# Altium schematic sheet BGA Modules.SchDoc: Schematic Sheet Test Title
size C; Organization: CXQ; Address1: RM 7401, 550 Jumen Rd, Huangpu District, Shanghai, China; Address2: Huangpu District; Address3: Shanghai; Address4: China; Revision: MB0004-01.A.1; SheetNumber: 1; SheetTotal: 99; PageSetup: Record=PageOptions|CenterHorizontal=True|CenterVertical=True|PrintScale=0.98|XCorrection=1.00|YCorrection=1.00|PrintKind=0|BorderSize=5000000|LeftOffset=0|BottomOffset=0|Orientation=2|PaperLength=1000|PaperWidth=1000|Scale=100|PaperSource=7|PrintQuality=-4|MediaType=1|DitherType=10|PaperKind=A4|PrintScaleMode=1; ProjectName: Project Name
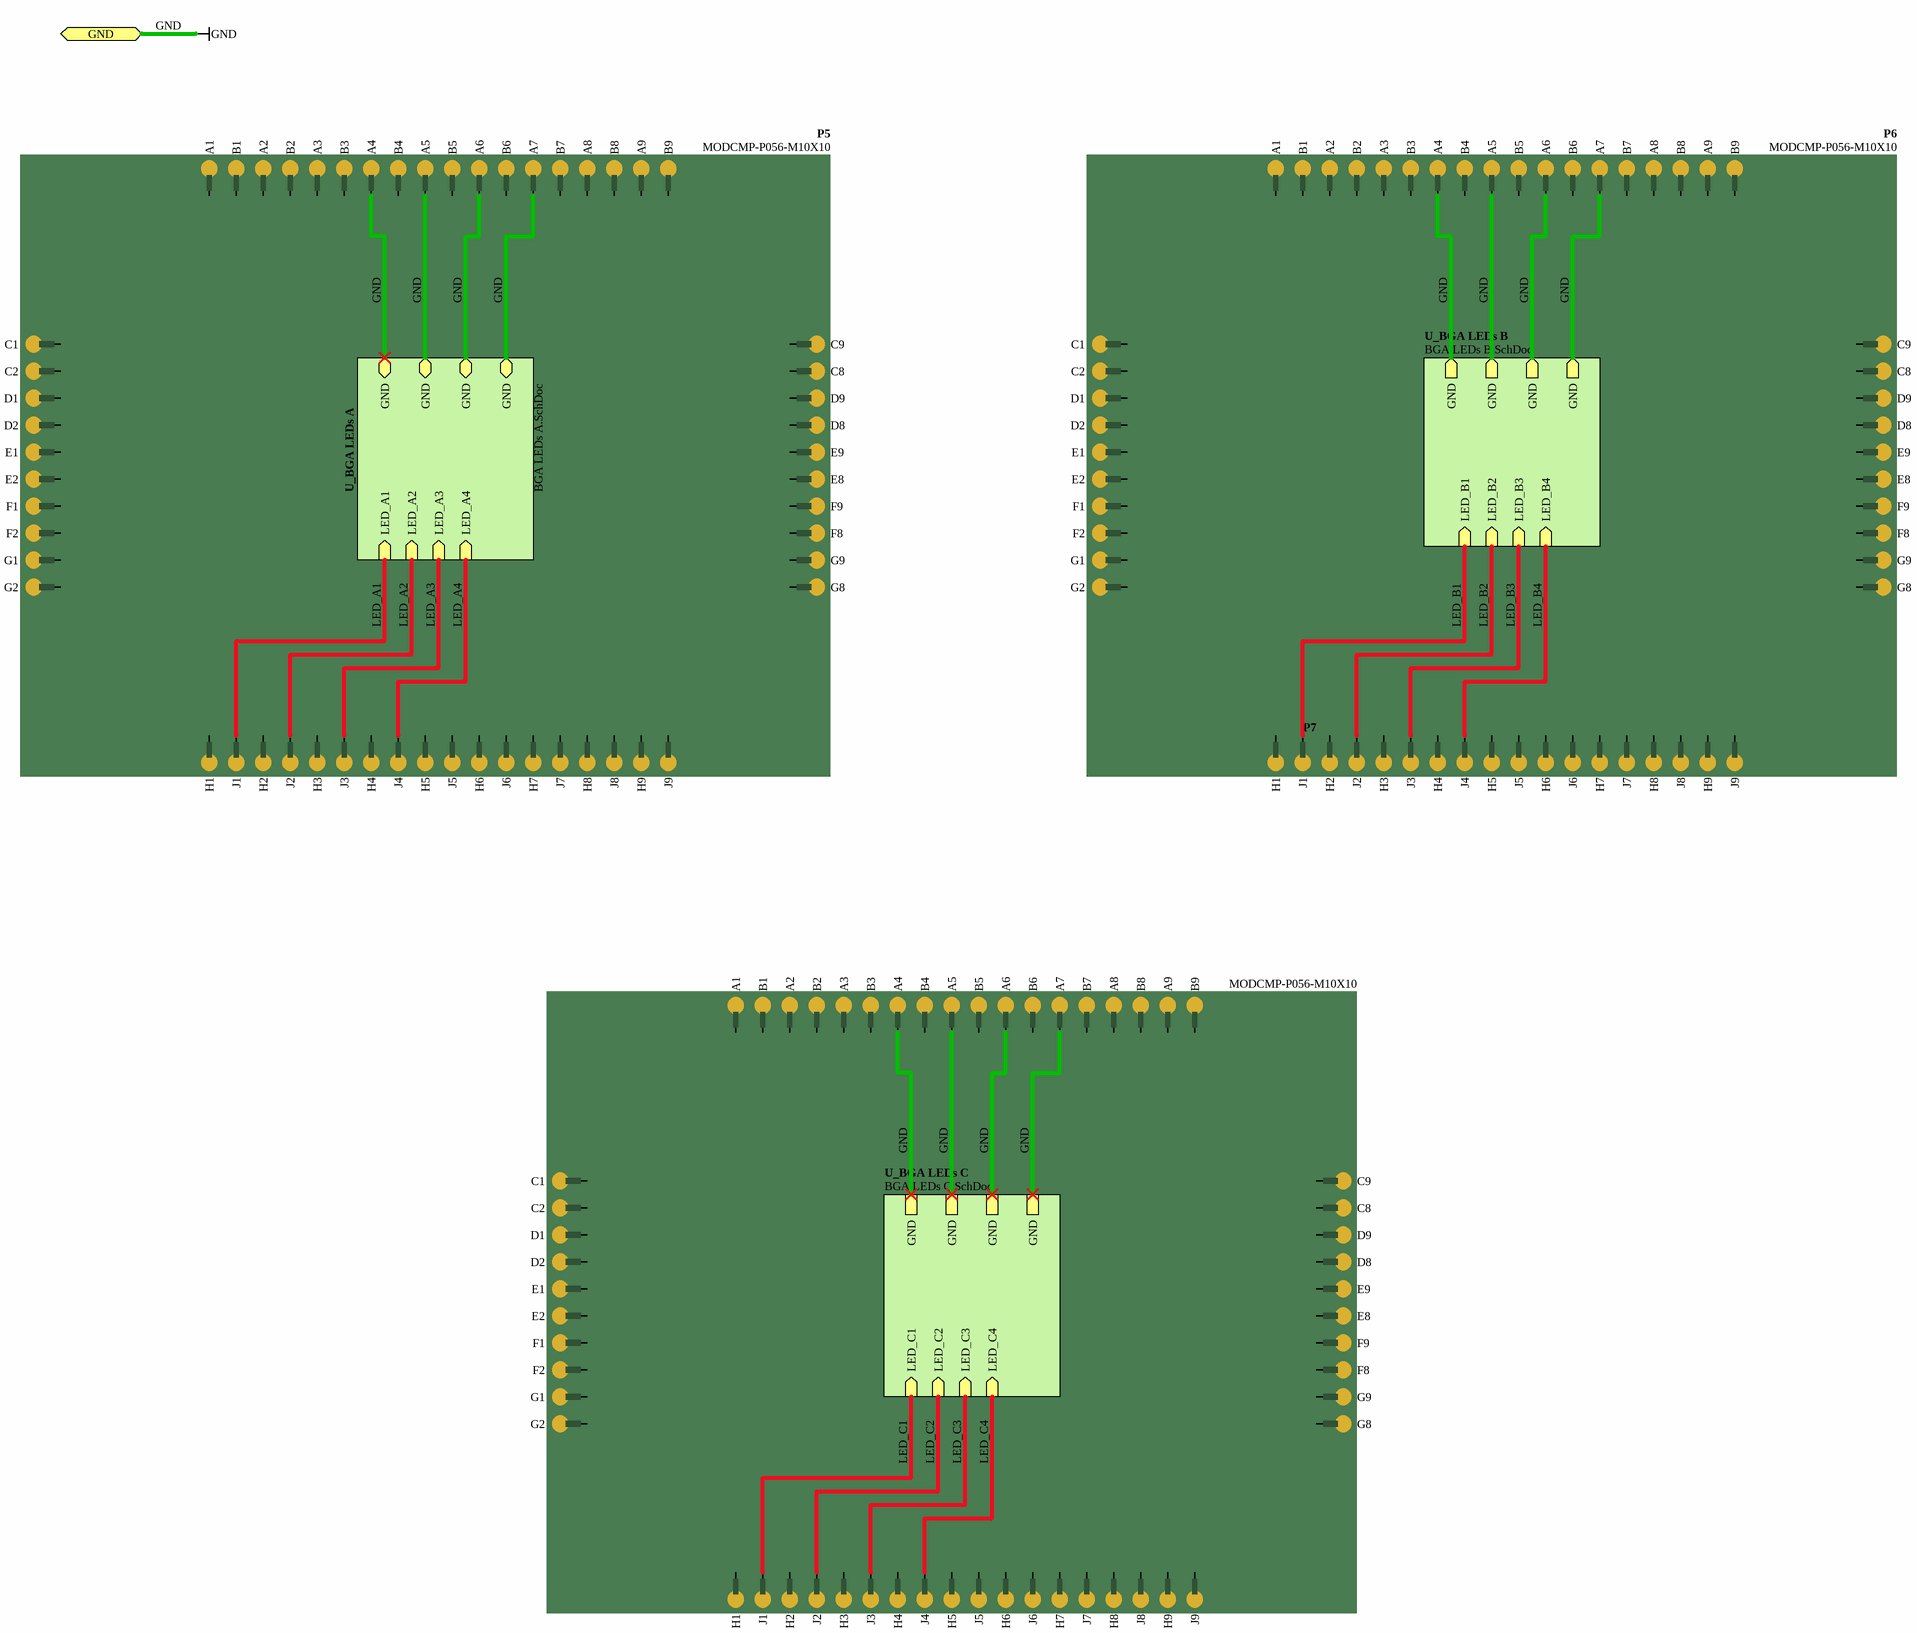
[diagram p0: BGA Modules.SchDoc]

## Parts
P5  MODCMP-P056-M10X10  [MODCMP-P056-M10X10]  (no BOM)
P6  MODCMP-P056-M10X10  [MODCMP-P056-M10X10]  (no BOM)
P7  MODCMP-P056-M10X10  [MODCMP-P056-M10X10]  (no BOM)

## Sub-sheets
U_BGA LEDs A = BGA LEDs A.SchDoc: LED_A1 (in), LED_A2 (in), LED_A3 (in), LED_A4 (in), GND, GND, GND, GND
U_BGA LEDs B = BGA LEDs B.SchDoc: LED_B1 (in), LED_B2 (in), LED_B3 (in), LED_B4 (in), GND, GND, GND, GND
U_BGA LEDs C = BGA LEDs C.SchDoc: LED_C1 (in), LED_C2 (in), LED_C3 (in), LED_C4 (in), GND, GND, GND, GND

## Ports
GND

## Nets
GND: P5.A4 P5.A5 P5.A6 P5.A7 P6.A4 P6.A5 P6.A6 P6.A7 P7.A4 P7.A5 P7.A6 P7.A7 ; port GND, sheet U_BGA LEDs A/GND, sheet U_BGA LEDs A/GND, sheet U_BGA LEDs A/GND, sheet U_BGA LEDs A/GND, sheet U_BGA LEDs B/GND, sheet U_BGA LEDs B/GND, sheet U_BGA LEDs B/GND, sheet U_BGA LEDs B/GND, sheet U_BGA LEDs C/GND, sheet U_BGA LEDs C/GND, sheet U_BGA LEDs C/GND, sheet U_BGA LEDs C/GND
LED_A1: P5.J1 ; sheet U_BGA LEDs A/LED_A1
LED_A2: P5.J2 ; sheet U_BGA LEDs A/LED_A2
LED_A3: P5.J3 ; sheet U_BGA LEDs A/LED_A3
LED_A4: P5.J4 ; sheet U_BGA LEDs A/LED_A4
LED_B1: P6.J1 ; sheet U_BGA LEDs B/LED_B1
LED_B2: P6.J2 ; sheet U_BGA LEDs B/LED_B2
LED_B3: P6.J3 ; sheet U_BGA LEDs B/LED_B3
LED_B4: P6.J4 ; sheet U_BGA LEDs B/LED_B4
LED_C1: P7.J1 ; sheet U_BGA LEDs C/LED_C1
LED_C2: P7.J2 ; sheet U_BGA LEDs C/LED_C2
LED_C3: P7.J3 ; sheet U_BGA LEDs C/LED_C3
LED_C4: P7.J4 ; sheet U_BGA LEDs C/LED_C4

Not connected (* = marked no-connect by the designer): P5 A1 A2 A3 A8 A9 B1 B2 B3 B4 B5 B6 B7 B8 B9 C1 C2 C8 C9 D1 D2 D8 D9 E1 E2 E8 E9 F1 F2 F8 F9 G1 G2 G8 G9 H1 H2 H3 H4 H5 H6 H7 H8 H9 J5 J6 J7 J8 J9; P6 A1 A2 A3 A8 A9 B1 B2 B3 B4 B5 B6 B7 B8 B9 C1 C2 C8 C9 D1 D2 D8 D9 E1 E2 E8 E9 F1 F2 F8 F9 G1 G2 G8 G9 H1 H2 H3 H4 H5 H6 H7 H8 H9 J5 J6 J7 J8 J9; P7 A1 A2 A3 A8 A9 B1 B2 B3 B4 B5 B6 B7 B8 B9 C1 C2 C8 C9 D1 D2 D8 D9 E1 E2 E8 E9 F1 F2 F8 F9 G1 G2 G8 G9 H1 H2 H3 H4 H5 H6 H7 H8 H9 J5 J6 J7 J8 J9

## Notes on the sheet
- A4
- DOCUMENT
- DATE
- TIME
- of
- SHEET
- ADDR
- FILE
- RM 7401, 550 Jumen Road
- Huangpu District, Shanghai, China
- www.mesheven.com

## Library data of the parts
P5-P7 = MOD-0100-0123: Module Component - 1mm Pitch, 56-Pin, 10mmX10mm; DefaultDesignator: P?; Sub Class: PCB - Module; Class: Module; ID: MOD-0100-0123; Manufacturer_PN: MODCMP-P056-M10X10